# EAGLE design ftdi_opto (EAGLE 5.12)
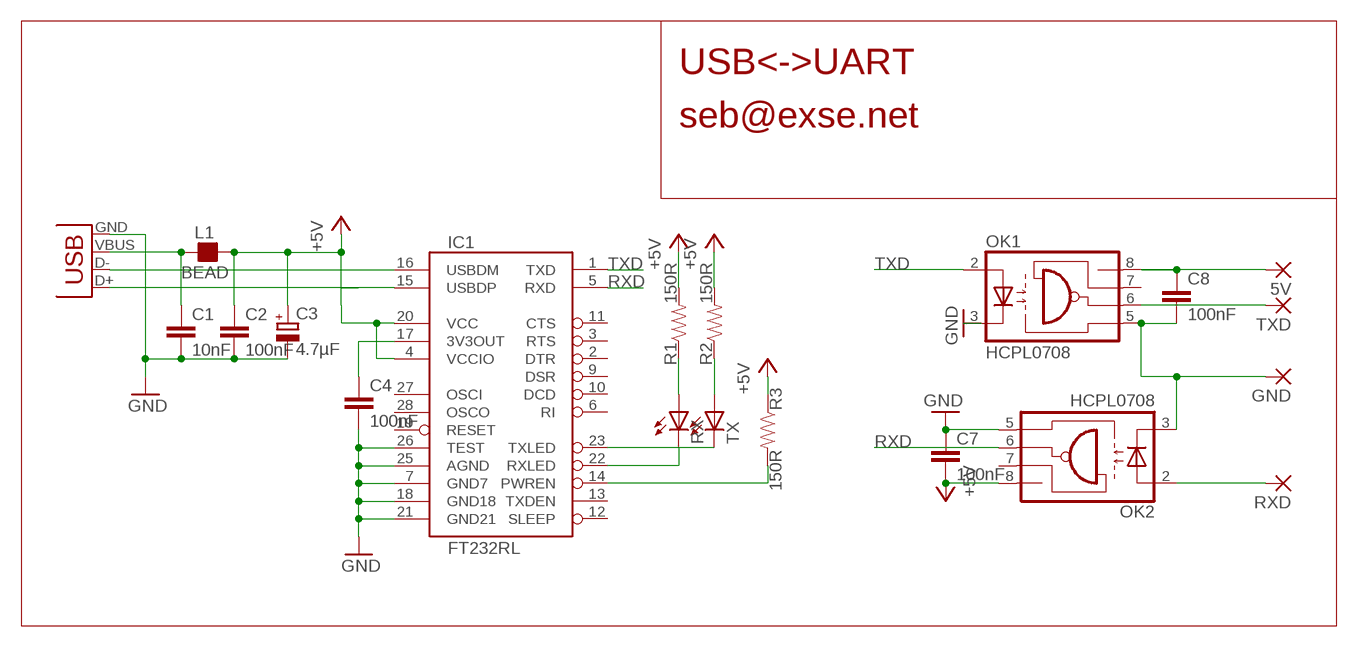
[diagram p0: schematic, sheet 1]

## Parts
5V  SMD2  [SMD1,27-2,54]
C1  10nF  CAP0805  [0805]
C2  100nF  CAP0805  [0805]
C3  4.7µF  CPOL-EUSMCC  [SMC_C]
C4  100nF  CAP0805  [0805]
C7  100nF  CAP0805  [0805]
C8  100nF  CAP0805  [0805]
GND  SMD2  [SMD1,27-2,54]
IC1  FT232RL  FT232RLSSOP  [SSOP28DB]
L1  BEAD  FB_0805  [L0805]
OK1  HCPL0708  HCPL0601  [SOIC08]
OK2  HCPL0708  HCPL0601  [SOIC08]
R1  150R  RESISTOR  [0805]
R2  150R  RESISTOR  [0805]
R3  150R  RESISTOR  [0805]
RX  LEDCHIP-LED0805  [CHIP-LED0805]
RXD  SMD2  [SMD1,27-2,54]
TX  LEDCHIP-LED0805  [CHIP-LED0805]
TXD  SMD2  [SMD1,27-2,54]
X1  USB-SMD-NS  [USB-MINIB-NOSTOP]

## Nets
+5V: C2.1 C3.+ C7.2 IC1.4(VCCIO) IC1.20(VCC) L1.2 OK2.8(VCC) R1.2 R2.2 R3.1
GND: C1.2 C2.2 C3.- C4.2 C7.1 IC1.7(GND7) IC1.18(GND18) IC1.21(GND21) IC1.25(AGND) IC1.26(TEST) OK1.3(C) OK2.5(GND) X1.GND
N$1: IC1.16(USBDM) X1.D-
N$2: IC1.15(USBDP) X1.D+
N$4: C1.1 L1.1 X1.VBUS
N$5: IC1.14(PWREN) R3.2
N$8: C8.2 GND.1(P) OK1.5(GND) OK2.3(C)
N$9: 5V.1(P) C8.1 OK1.8(VCC)
N$10: OK1.6(VO) TXD.1(P)
N$11: OK2.2(A) RXD.1(P)
N$19: R1.1 RX.A
N$20: R2.1 TX.A
N$27: IC1.22(RXLED) RX.C
N$28: IC1.23(TXLED) TX.C
N$29: C4.1 IC1.17(3V3OUT)
RXD: IC1.5(RXD) OK2.6(VO)
TXD: IC1.1(TXD) OK1.2(A)
Unconnected: IC1.2(DTR) IC1.3(RTS) IC1.6(RI) IC1.9(DSR) IC1.10(DCD) IC1.11(CTS) IC1.12(SLEEP) IC1.13(TXDEN) IC1.19(RESET) IC1.27(OSCI) IC1.28(OSCO) OK1.7(VE) OK2.7(VE)

## Notes on the sheet
- USB<->UART
- seb@exse.net

## Library data of the parts
5V GND RXD TXD = wirepad:SMD2: SMD PAD
C1 C2 C4 C7 C8 = SparkFun:CAP: Capacitor Standard 0603 ceramic capacitor, and 0.1" leaded capacitor.
C3 = resistor:CPOL-EU: POLARIZED CAPACITOR, European symbol
IC1 = SparkFun:FT232RL: USB UART FT232RL 4th Generation USB UART (USB <-> Serial) Controller. Spark Fun Electronics SKU : COM-00650
L1 = rc-master-smd:FB_: FERRITE BEAD
OK1 OK2 = optocoupler:HCPL0601: HEWLETT PACKARD OPTO COUPLER; MF: AGILENT TECHNOLOGIES; MPN: HCPL-0601-000E; OC_FARNELL: 9995102; OC_NEWARK: 88H7776
R1-R3 = SparkFun:RESISTOR: Resistor Basic schematic elements and footprints for 0603, 1206, and PTH 1/10th watt (small) resistors.
RX TX = led:LED: LED OSRAM: - CHIPLED LG R971, LG N971, LY N971, LG Q971, LY Q971, LO R971, LY R971 LH N974, LH R974 LS Q976, LO Q976, LY Q976 LO Q996 - Hyper CHIPLED LW Q18S LB Q993, LB Q99A, LB R99A - SideLED LS A670, LO A670, LY A670, LG A670, LP A670 LB A673, LV A673, LT A673, LW A673 LH A674 LY A675 LS A676, LA A676, LO A676, LY A676, LW A676 LS A679, LY A679, LG A679 - Hyper Micro SIDELED® LS Y876, LA Y876, LO Y876, LY Y876 LT Y87S - SmartLED LW L88C, LW L88S LB L89C, LB L89S, LG L890 LS L89K, LO L89K, LY L89K LS L896, LA L896, LO L896, LY L896 - TOPLED LS T670, LO T670, LY T670, LG T670, LP T670 LSG T670, LSP T670, LSY T670, LOP T670, LYG T670 LG T671, LOG T671, LSG T671 LB T673, LV T673, LT T673, LW T673 LH T674 LS T676, LA T676, LO T676, LY T676, LB T676, LH T676, LSB T676, LW T676 LB T67C, LV T67C, LT T67C, LS T67K, LO T67K, LY T67K, LW E67C LS E67B, LA E67B, LO E67B, LY E67B, LB E67C, LV E67C, LT E67C LW T67C LS T679, LY T679, LG T679 LS T770, LO T770, LY T770, LG T770, LP T770 LB T773, LV T773, LT T773, LW T773 LH T774 LS E675, LA E675, LY E675, LS T675 LS T776, LA T776, LO T776, LY T776, LB T776 LHGB T686 LT T68C, LB T68C - Hyper Mini TOPLED® LB M676 - Mini TOPLED Santana® LG M470 LS M47K, LO M47K, LY M47K Source: http://www.osram.convergy.de LUXEON: - LUMILED® LXK2-PW12-R00, LXK2-PW12-S00, LXK2-PW14-U00, LXK2-PW14-V00 LXK2-PM12-R00, LXK2-PM12-S00, LXK2-PM14-U00 LXK2-PE12-Q00, LXK2-PE12-R00, LXK2-PE12-S00, LXK2-PE14-T00, LXK2-PE14-U00 LXK2-PB12-K00, LXK2-PB12-L00, LXK2-PB12-M00, LXK2-PB14-N00, LXK2-PB14-P00, LXK2-PB14-Q00 LXK2-PR12-L00, LXK2-PR12-M00, LXK2-PR14-Q00, LXK2-PR14-R00 LXK2-PD12-Q00, LXK2-PD12-R00, LXK2-PD12-S00 LXK2-PH12-R00, LXK2-PH12-S00 LXK2-PL12-P00, LXK2-PL12-Q00, LXK2-PL12-R00 Source: www.luxeon.com KINGBRIGHT: KA-3528ASYC Source: www.kingbright.com
X1 = SparkFun:USB: USB Connectors USB-B-PTH is fully proven SKU : PRT-00139 USB-miniB is fully proven SKU : PRT-00587 USB-A-PCB is untested. USB-A-H is throughly reviewed, but untested. Spark Fun Electronics SKU : PRT-00437 USB-B-SMT is throughly reviewed, but untested. Needs silkscreen touching up. USB-A-S has not been used/tested USB-MB-H has not been used/tested

## Board
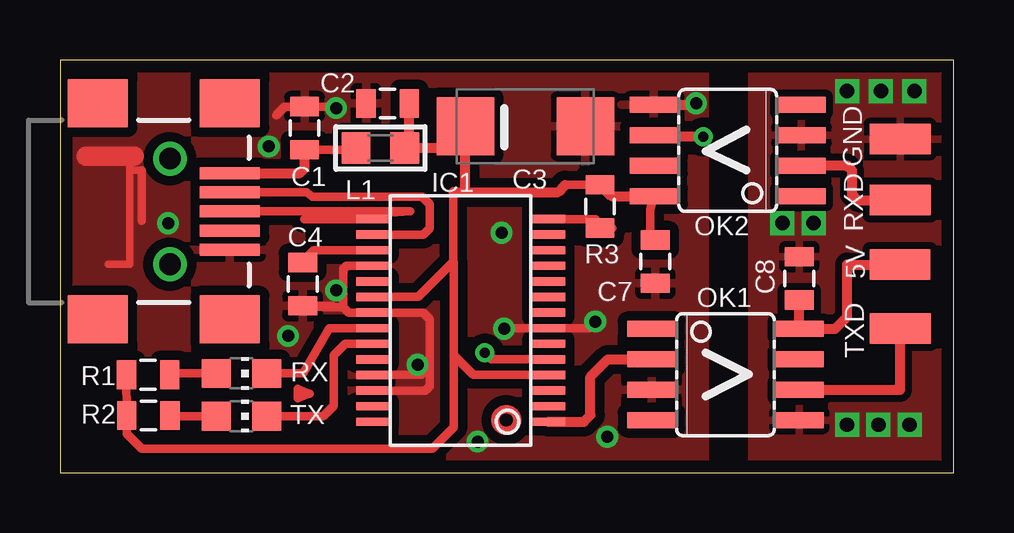
[diagram p1: board, top side]
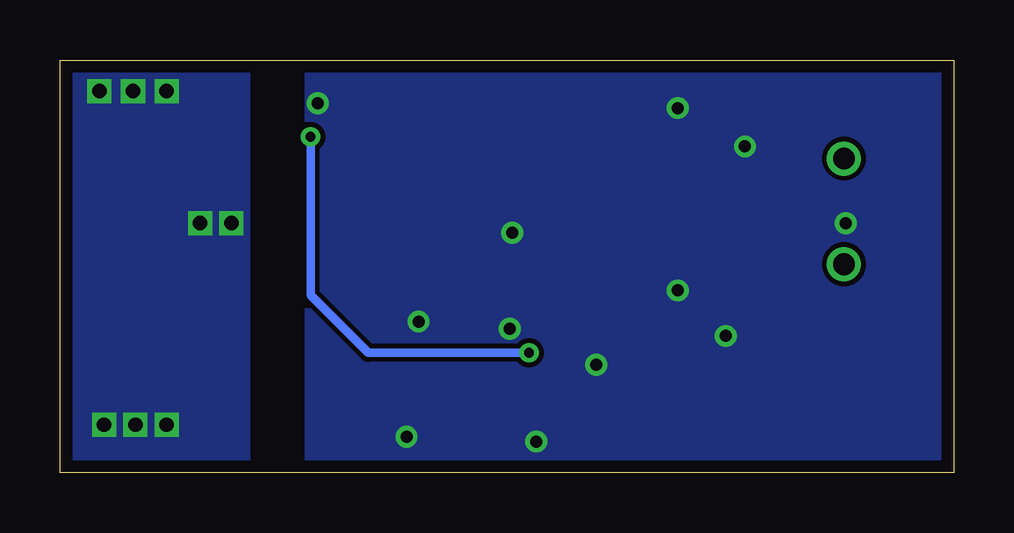
[diagram p2: board, bottom side, seen from below]

Size 37.24 x 17.2 mm. Coordinates in mm from the lower left corner, seen from the top.
Outline: 0,0 37.24,0 37.24,17.2 0,17.2 0,0
Copper layers (1*16): Top 0.035mm / dielectric 1.5mm / Bottom 0.035mm
Design rules "default *": minimum track width 10mil, minimum drill 0.3mm, track to track 8mil, track to pad 8mil, pad to pad 8mil, via to via 8mil, smd to smd 8mil, copper to edge 20mil, drill to drill 8mil, minimum pad ring 10mil, minimum via ring 8mil, stop-mask expansion 4mil, vias tented up to drill 50mil, thermal gap 10mil
tRestrict: 1 lines

### Footprints (pad centres in the part's own frame; a part is rotated, then mirrored left to right if it is on the bottom)
SMD1,27-2,54 = smd 1.27 x 2.54: 1 0,0
0805 = smd 0.8 x 1.2: 1 -0.9,0; 2 0.9,0
SMC_C = smd 2.4 x 2.4: + -2.5,0; - 2.5,0
SSOP28DB = smd 0.348 x 1.397: 1 -4.225,-3.656; 2 -3.575,-3.656; 3 -2.925,-3.656; 4 -2.275,-3.656; 5 -1.625,-3.656; 6 -0.975,-3.656; 7 -0.325,-3.656; 8 0.325,-3.656; 9 0.975,-3.656; 10 1.625,-3.656; 11 2.275,-3.656; 12 2.925,-3.656; 13 3.575,-3.656; 14 4.225,-3.656; 15 4.225,3.656; 16 3.575,3.656; 17 2.925,3.656; 18 2.275,3.656; 19 1.625,3.656; 20 0.975,3.656; 21 0.325,3.656; 22 -0.325,3.656; 23 -0.975,3.656; 24 -1.625,3.656; 25 -2.275,3.656; 26 -2.925,3.656; 27 -3.575,3.656; 28 -4.225,3.656
L0805 = smd 1.2 x 1.3: 1 -1.016,0; 2 1.016,0
SOIC08 = smd 0.66 x 2.032: 1 -1.905,-3.073; 2 -0.635,-3.073; 3 0.635,-3.073; 4 1.905,-3.073; 5 1.905,3.073; 6 0.635,3.073; 7 -0.635,3.073; 8 -1.905,3.073
CHIP-LED0805 = smd 1.2 x 1.2: A 0,-1.05; C 0,1.05
USB-MINIB-NOSTOP = smd 2.5 x 0.5: D+ 2.5,0; D- 2.5,0.8; GND 2.5,-1.6; ID 2.5,-0.8; VBUS 2.5,1.6 | smd 2.5 x 2: G1 -3,-4.5; G2 -3,4.5; G3 2.5,4.5; G4 2.5,-4.5 | drill 0.9 pad 0.8 round: H1 0,2.2 | drill 0.9 pad 0.787 round: H2 0,-2.2

### Placement (x,y rotation side)
5V  35,8.67 90 top
C1  10.19,14.36 90 top
C2  13.65,15.39 180 top
C3  19.39,14.44 0 top
C4  10.11,7.86 270 top
C7  24.8,8.8 90 top
C8  30.8,8.1 90 top
GND  35.01,13.9 90 top
IC1  16.69,6.35 90 top
L1  13.35,13.53 0 top
OK1  27.72,4.09 270 top
OK2  27.82,13.43 90 top
R1  3.67,4.09 180 top
R2  3.68,2.39 180 top
R3  22.5,11.1 270 top
RX  7.56,4.14 270 top
RXD  35,11.36 90 top
TX  7.56,2.36 270 top
TXD  35,6.01 90 top
X1  4.58,10.89 0 top

### Tracks (layer width: path | path; a pad name or v marks a point on that pad's centre or on a via)
+5V
  Top 0.35: IC1.20 14.93,7.33 16.39,8.79 | R1.2 R2.2 2.78,1.62 3.4,1 15.5,1 16.4,1.9 | 16.4,1.9 16.39,1.91 | 16.39,8.79 16.39,11.7 | 21.05,12 R3.1 | IC1.4 17.23,4.08 16.4,4.9 | 16.4,4.9 16.4,8.78 16.39,8.79 | 16.4,1.9 16.4,4.9 | OK2.8 24.6,10.98 24.6,9.9 24.6,9.7 C7.2
  Top 0.406: 21.05,12 20.75,11.7 16.9,11.7 | 16.39,11.7 16.9,11.7 | OK2.8 22.97,11.53 R3.1 | C2.1 14.55,13.71 L1.2 16.89,13.53 | 16.89,13.53 C3.+ | 16.89,13.53 16.89,11.7 16.9,11.7
GND  (via drill 0.5)
  Top 0.305: 2.9,12.6 3.4,12.6 | 2.9,12.6 2.9,13.2 | 2,8.7 2.9,8.7 2.9,12.6
  Top 0.35: IC1.26 15.22,3.43 15.4,3.6 15.4,4.4 | 15.4,4.4 15.4,6.4 15.12,6.68 IC1.21 12.03,6.68 11.8,6.9 | IC1.25 15.07,4.08 15.4,4.4 | 11.8,6.9 11.8,8.5 11.93,8.62 IC1.18 | 11.8,6.9 10.97,6.9 C4.2 11.34,6.96 | 11.36,15.26 C1.2 9.36,15.26 9,14.9 | 3.4,12.6 3.4,10.5 | 20.23,6.03 18.52,6.03 v18.5,6 | 20.23,6.03 IC1.7 | 20.23,6.03 22.05,6.03
  Top 0.406: OK2.5 26.34,15.34 v26.5,15.4
  Top 0.813: 1.1,13.2 2.9,13.2 3.1,13.2
  other vias: 9.5,5.7 11.5,7.6 14.9,4.5 18.4,10 11.5,15.2 8.7,13.6 4.5,10.4 22.8,1.5 22.3,6.3 17.4,1.3
  pour Top (isolate 0.4): 0,0 26.86,0.2 26.86,17.4 0,17.2
  pour Bottom: 26.88,17.4 0,17.2 0,0 26.88,0.2
N$1
  Top 0.35: IC1.16 15.12,9.93 15.4,10.2 15.4,11.2 15.1,11.5 10.5,11.5 10.29,11.69 X1.D-
N$2
  Top 0.35: X1.D+ 14.59,10.89 10.18,10.57 IC1.15
N$3
  Top 0.35: 9.9,3.5 9.9,3.1 10.4,3.3 9.9,3.5
N$4
  Top 0.35: C1.1 12.36,13.46 L1.1
  Top 0.406: X1.VBUS 9.99,12.49 10.19,12.69 C1.1 | L1.1 12.33,13.43
N$5
  Top 0.35: IC1.14 22.32,10.57 R3.2 23,10.2
N$8  (via drill 0.6)
  other vias: 30.1,10.4 31.4,10.4 34.1,2 34.2,15.9 32.8,2 35.4,2 32.8,15.9 35.6,15.9
  pour Bottom: 29.53,0.23 37.45,0.03 37.45,17.3 29.53,17.5
  pour Top (isolate 0.3): 28.83,0.03 37.45,0.03 37.45,17.3 28.83,17.3
N$9
  Top 0.35: OK1.8
  Top 0.406: OK1.8 C8.1 | 5V.1 32.8,8.67 32.8,6.5 32.3,6 OK1.8
N$10
  Top 0.406: TXD.1 35,3.46 OK1.6
N$11
  Top 0.406: OK2.2 32.8,12.8 33,12.6 33,11.6 33.24,11.36 RXD.1
N$19
  Top 0.35: R1.1 4.72,4.14 RX.A
N$20
  Top 0.35: R2.1 4.71,2.36 TX.A
N$27
  Top 0.35: RX.C 10.14,4.14 11.22,6.03 IC1.22
N$28
  Top 0.35: IC1.23 11.88,5.38 11.4,4.9 11.4,2.8 10.96,2.36 TX.C
N$29
  Top 0.35: C4.1 10.06,8.76 10.57,9.28 IC1.17
RXD  (via drill 0.4)
  Top 0.35: IC1.5 17.98,4.73 v17.7,5
  Top 0.406: v26.8,14 24.82,14 OK2.6
  Bottom 0.35: v17.7,5 24.4,5 26.8,7.4 v26.8,14
TXD
  Top 0.406: IC1.1 21.82,2.12 22.1,2.4 22.1,4 22.83,4.73 OK1.2
(copper drawn outside any net)
  shapes: Top circle x1

### Text on the board
bStop: GND | seb@exse.net | RX | 5V | TX | UART <-> USB